# Altium schematic sheet Connectors.SchDoc
size 406 x 304 mm; SheetNumber: 8; SheetTotal: 10
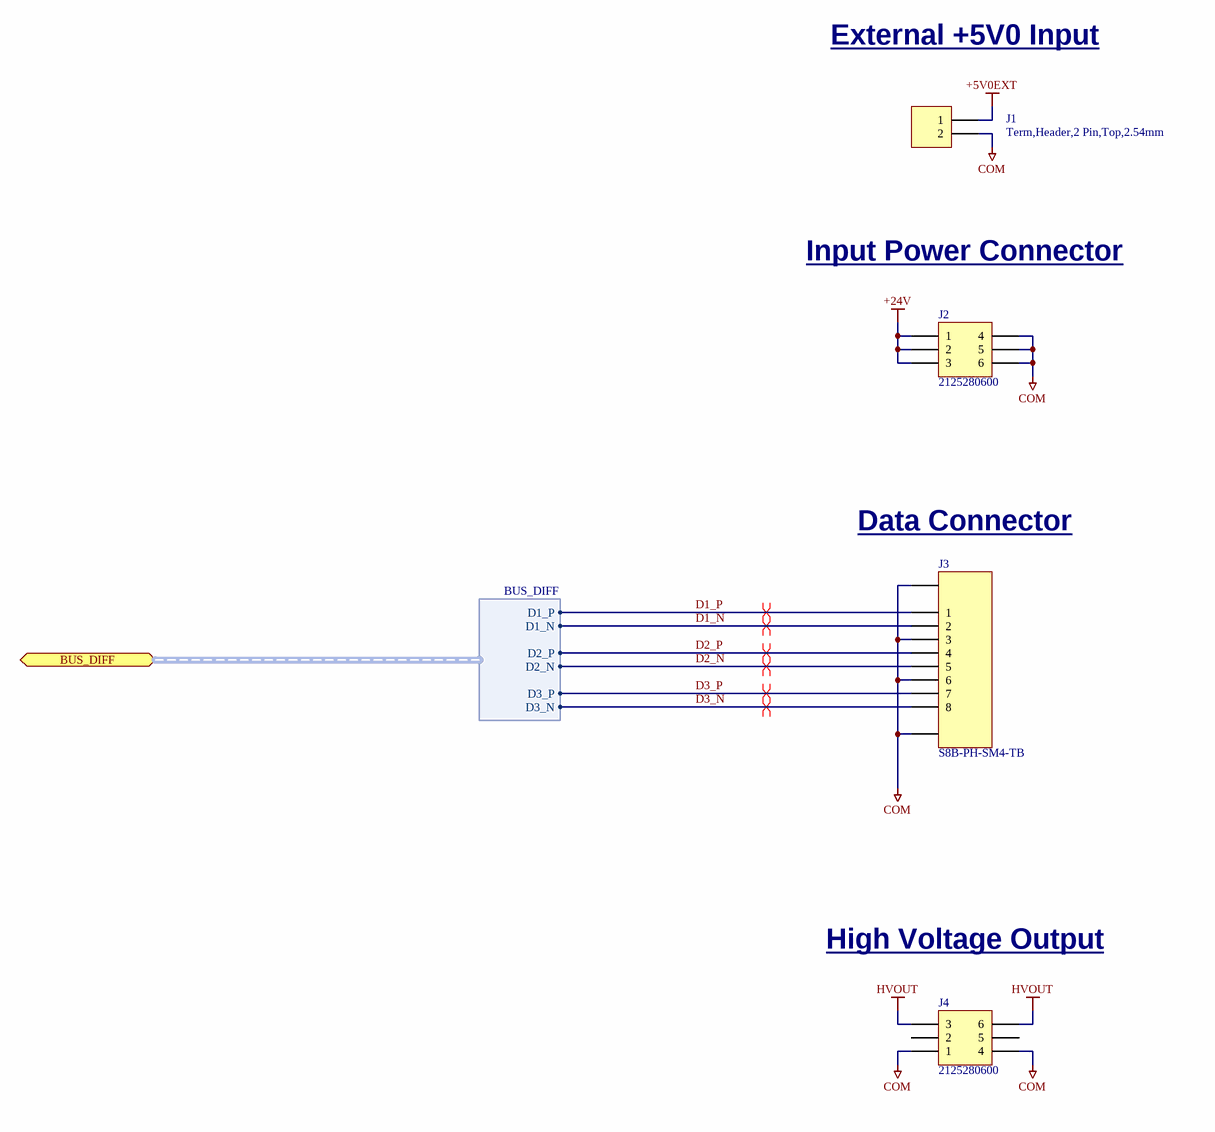
[diagram p0: Connectors.SchDoc]

## Parts
J1  Term,Header,2 Pin,Top,2.54mm  [WURTH_61300211121]
J2  2125280600  [MOLEX_2125280600]
J3  S8B-PH-SM4-TB  [JST_S8B-PH-SM4-TB]
J4  2125280600  [MOLEX_2125280600]

## Ports
BUS_DIFF (bidir, harness BUS_DIFF)

## Harnesses
BUS_DIFF: D1_P, D1_N, D2_P, D2_N, D3_P, D3_N

## Nets
+5V0EXT: J1.1
+24V: J2.1 J2.2 J2.3
COM: J1.2 J2.4 J2.5 J2.6 J3.0 J3.3 J3.6 J4.1 J4.4
HVOUT: J4.3 J4.6
D1_N: J3.2 ; port BUS_DIFF.D1_N
D1_P: J3.1 ; port BUS_DIFF.D1_P
D2_N: J3.5 ; port BUS_DIFF.D2_N
D2_P: J3.4 ; port BUS_DIFF.D2_P
D3_N: J3.8 ; port BUS_DIFF.D3_N
D3_P: J3.7 ; port BUS_DIFF.D3_P

Not connected (* = marked no-connect by the designer): J4 2 5

## Layout directives
differential pair: D1_N, D1_P, D2_N, D2_P, D3_N, D3_P

## Notes on the sheet
- External +5V0 Input
- Input Power Connector
- (near J3) Data Connector
- High Voltage Output
- Sheet Name:
- Date:
- Sheet
- Designer:
- of

## Library data of the parts
J1 = Term,Header,2 Pin,Top,2.54mm: Connector Header Through Hole 2 position 0.100" (2.54mm); Manufacturer 1: WÃ¼rth Elektronik; Manufacturer 1 Part Number: 61300211121; Vendor 1 Part Number: 732-5315-ND; Vendor 1: DigiKey; Part Name: Term,Header,2 Pin,Top,2.54mm; CreatedBy: Judd Foster; HelpURL: https://www.we-online.com/components/products/datasheet/61300211121.pdf
J2 J4 = Conn,Micro-Fit,Hdr,6Pos,RA,Thru: Connector Header Through Hole, Right Angle 6 position 0.118" (3.00mm); Manufacturer 1: Molex; Vendor 1 Part Number: 900-2125280600-ND; Vendor 1: Digikey; Part Name: Conn,Micro-Fit,Hdr,6Pos,RA,Thru; CreatedBy: Judd Foster; HelpURL: https://www.molex.com/webdocs/datasheets/pdf/en-us/2125280600_PCB_HEADERS.pdf; Manufacturer 1 Part Number: 2125280600
J3 = CONN,JST,8 Pin,2mm,RA,SMD: Connector Header Surface Mount, Right Angle 8 position 0.079" (2.00mm); Manufacturer 1: JST Sales America Inc.; Vendor 1 Part Number: 455-S8B-PH-SM4-TBCT-ND; Vendor 1: DigiKey; Part Name: CONN,JST,8 Pin,2mm,RA,SMD; CreatedBy: Judd Foster; HelpURL: https://www.jst-mfg.com/product/pdf/eng/ePH.pdf; Manufacturer 1 Part Number: S8B-PH-SM4-TB